# EAGLE design schema_electrica (EAGLE 8.1.1)
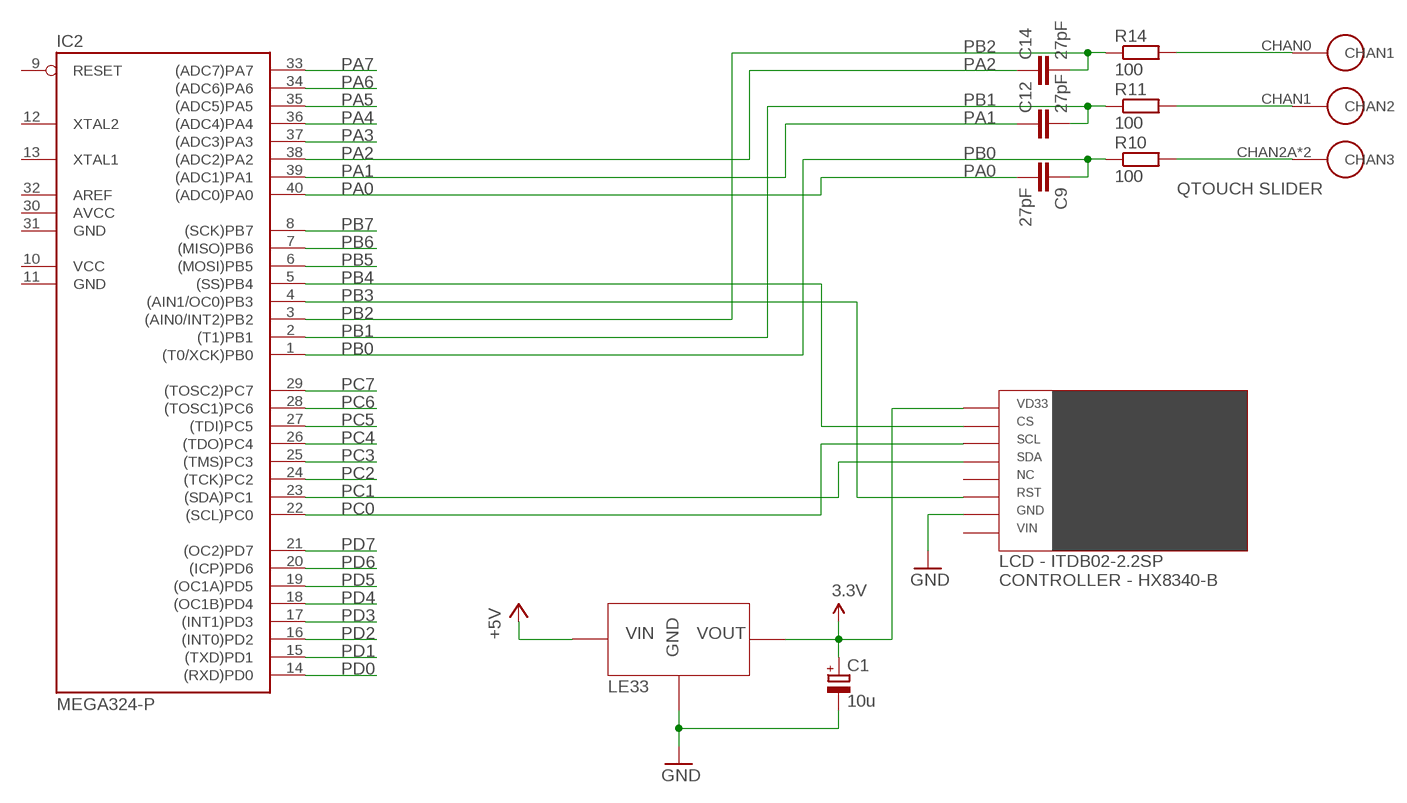
[diagram p0: schematic, sheet 1]

## Parts
C1  10u  CPOL-EUE2.5-5  [E2,5-5]
C9  27pF  C-EUC1206  [C1206]
C12  27pF  C-EUC1206  [C1206]
C14  27pF  C-EUC1206  [C1206]
IC2  MEGA324-P  MEGA16-P  [DIL40]
R10  100  R-EU_M1206  [M1206]
R11  100  R-EU_M1206  [M1206]
R14  100  R-EU_M1206  [M1206]
U$1  QT_SLIDER  [QT_SLIDER]

## Nets
3.3V: C1.+
GND: C1.-
N$5: R14.2 U$1.CHAN0(CHAN1)
N$6: R11.2 U$1.CHAN1(CHAN2)
N$7: R10.2 U$1.CHAN2A(CHAN3) U$1.CHAN2B(CHAN3)
PA0: C9.2 IC2.40((ADC0)PA0)
PA1: C12.1 IC2.39((ADC1)PA1)
PA2: C14.1 IC2.38((ADC2)PA2)
PA3: IC2.37((ADC3)PA3)
PA4: IC2.36((ADC4)PA4)
PA5: IC2.35((ADC5)PA5)
PA6: IC2.34((ADC6)PA6)
PA7: IC2.33((ADC7)PA7)
PB0: C9.1 IC2.1((T0/XCK)PB0) R10.1
PB1: C12.2 IC2.2((T1)PB1) R11.1
PB2: C14.2 IC2.3((AIN0/INT2)PB2) R14.1
PB3: IC2.4((AIN1/OC0)PB3)
PB4: IC2.5((SS)PB4)
PB5: IC2.6((MOSI)PB5)
PB6: IC2.7((MISO)PB6)
PB7: IC2.8((SCK)PB7)
PC0: IC2.22((SCL)PC0)
PC1: IC2.23((SDA)PC1)
PC2: IC2.24((TCK)PC2)
PC3: IC2.25((TMS)PC3)
PC4: IC2.26((TDO)PC4)
PC5: IC2.27((TDI)PC5)
PC6: IC2.28((TOSC1)PC6)
PC7: IC2.29((TOSC2)PC7)
PD0: IC2.14((RXD)PD0)
PD1: IC2.15((TXD)PD1)
PD2: IC2.16((INT0)PD2)
PD3: IC2.17((INT1)PD3)
PD4: IC2.18((OC1B)PD4)
PD5: IC2.19((OC1A)PD5)
PD6: IC2.20((ICP)PD6)
PD7: IC2.21((OC2)PD7)
Unconnected: IC2.9(RESET) IC2.12(XTAL2) IC2.13(XTAL1) IC2.32(AREF)

## Notes on the sheet
- QTOUCH SLIDER
- VD33
- CS
- SCL
- SDA
- NC
- RST
- GND
- VIN
- LCD - ITDB02-2.2SP
  CONTROLLER - HX8340-B
- VIN | VOUT
- GND
- LE33

## Power pins joined to a net without a drawn wire
AVCC: IC2.30(AVCC)
GND: IC2.11(GND) IC2.31(GND)
VCC: IC2.10(VCC)

## Library data of the parts
C1 = resistor:CPOL-EU: POLARIZED CAPACITOR, European symbol
C9 C12 C14 = resistor:C-EU: CAPACITOR, European symbol
IC2 = atmel:MEGA16-P: MICROCONTROLLER 16 Kbytes FLASH 1 kbytes SRAM 512 bytes EEPROM USART 8-channel 10 bit ADC Source: avr.lbr; MPN: ATMEGA16-16PU; OC_FARNELL: 9171142; OC_NEWARK: 01M6885
R10 R11 R14 = resistor:R-EU_: RESISTOR, European symbol
U$1 = 0andrei_custom:QT_SLIDER

## Net classes
1 power: width 0.61 mm

## Board
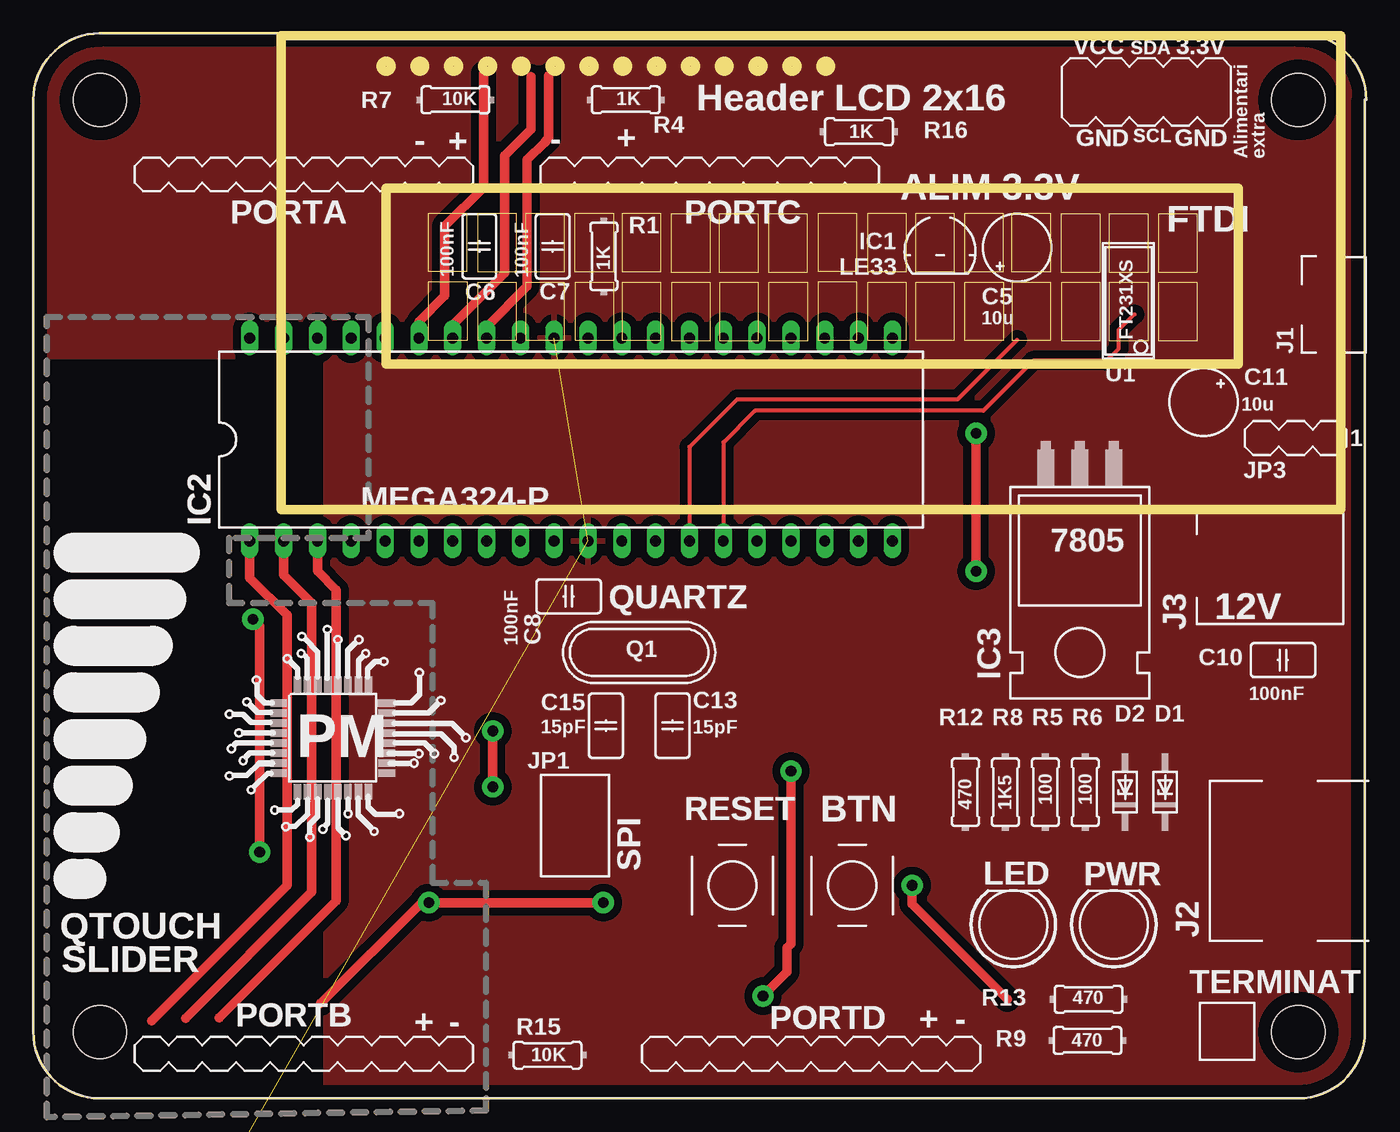
[diagram p1: board, top side]
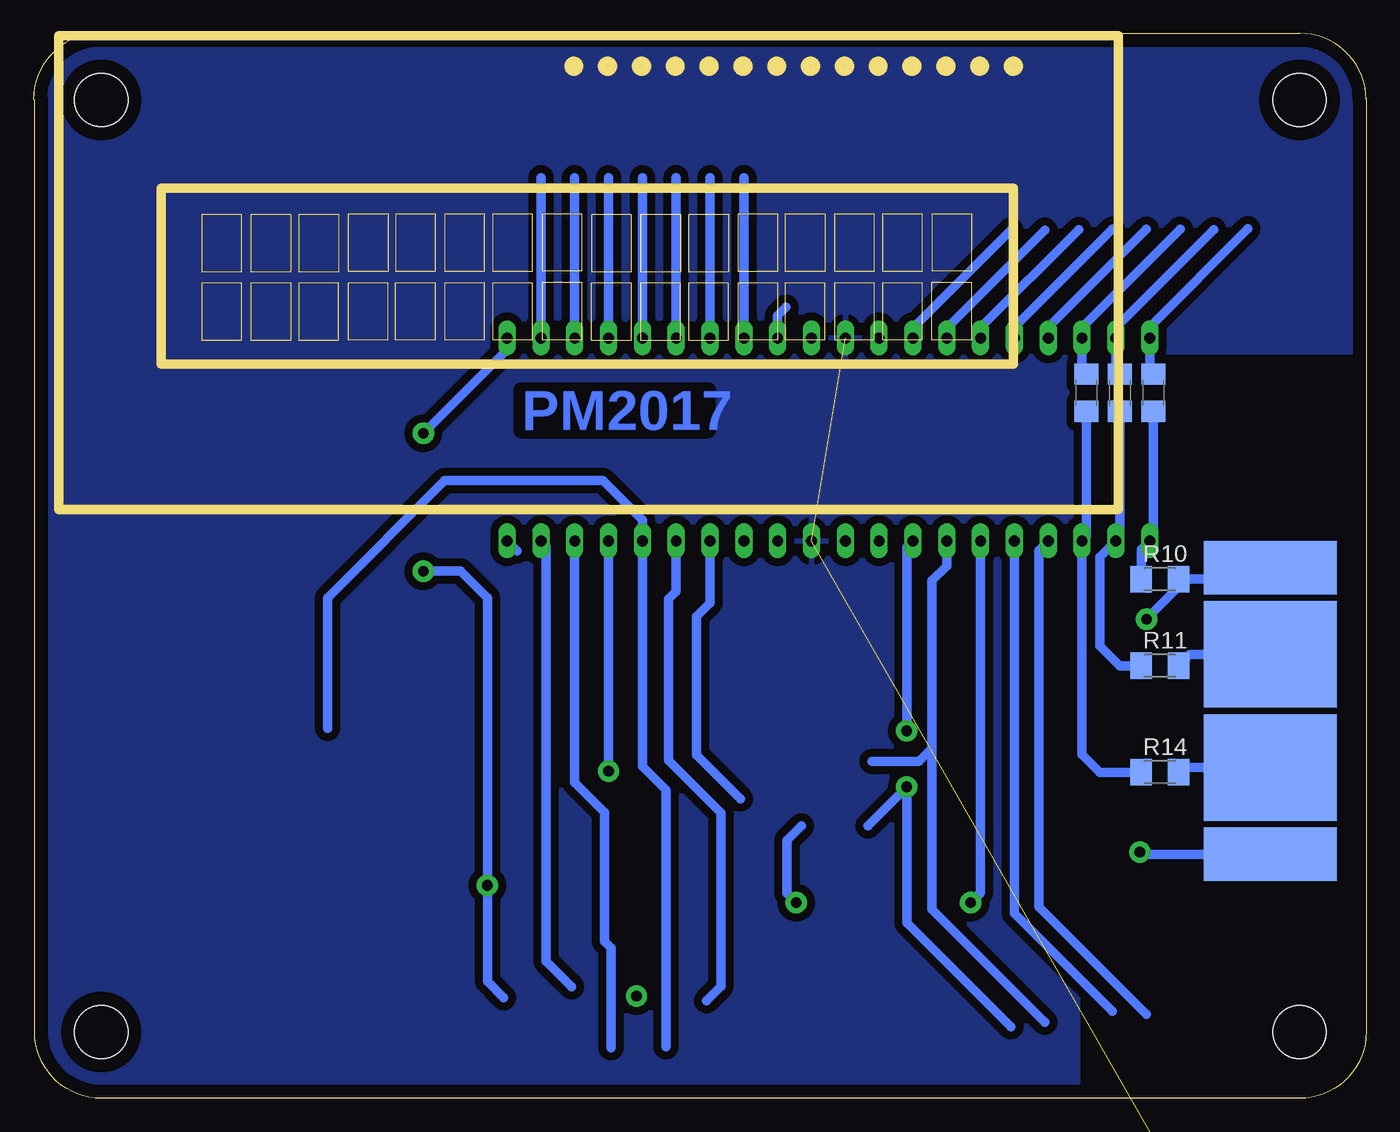
[diagram p2: board, bottom side, seen from below]

Size 100.1 x 80 mm. Coordinates in mm from the lower left corner, seen from the top.
Outline: 100,75 100,5 arc-90 95,0 5,0 arc-90 0,5 0,75 arc-90 5,80 95,80
Outline: 95.1,80 arc-90 100.1,75
Copper layers (1*16): Top 0.035mm / dielectric 1.5mm / Bottom 0.035mm
Design rules "default": minimum track width 10mil, minimum drill 0.6mm, track to track 0.3mm, track to pad 0.3mm, pad to pad 0.3mm, via to via 0.3mm, smd to smd 0mil, copper to edge 40mil, drill to drill 10mil, minimum pad ring 10mil, minimum via ring 8mil, stop-mask expansion 0mil, vias tented up to drill 0mil, thermal gap 20mil
Holes 4 mm at 95,75 5,5 5,75 95,5
Milling: area 26.1,77.2 to 26.9,77.9; area 28.7,77.2 to 29.4,77.9; area 31.2,77.2 to 31.9,77.9; area 33.8,77.2 to 34.5,77.9; area 36.3,77.2 to 37,77.9; area 38.8,77.2 to 39.6,77.9; area 41.4,77.2 to 42.1,77.9; area 43.9,77.2 to 44.6,77.9; area 46.5,77.2 to 47.2,77.9; area 49,77.2 to 49.7,77.9; area 51.5,77.2 to 52.3,77.9; area 54.1,77.2 to 54.8,77.9; area 56.6,77.2 to 57.3,77.9; area 59.2,77.2 to 59.9,77.9; area 29.6,62.1 to 32.6,66.5; area 33.4,62.1 to 36.3,66.4; area 37,62.1 to 39.9,66.4; area 40.7,62.1 to 43.6,66.4; area 29.7,57 to 32.6,61.3; area 33.4,56.9 to 36.3,61.3; area 37,56.9 to 39.9,61.3; area 40.7,56.9 to 43.6,61.3; area 44.2,62.1 to 47.1,66.5; area 47.9,62.1 to 50.8,66.4; area 51.5,62.1 to 54.5,66.4; area 55.2,62.1 to 58.1,66.4; area 44.2,57 to 47.1,61.3; area 47.9,56.9 to 50.9,61.3; area 51.5,56.9 to 54.5,61.3; area 55.2,56.9 to 58.2,61.3; area 58.9,62.1 to 61.9,66.5; area 62.6,62.1 to 65.6,66.4; area 66.2,62.1 to 69.2,66.4; area 69.9,62.1 to 72.9,66.4; area 58.9,57 to 61.9,61.3; area 62.6,56.9 to 65.6,61.3; area 66.2,56.9 to 69.2,61.3; area 69.9,56.9 to 72.9,61.3; area 73.5,62.1 to 76.4,66.5; area 77.2,62.1 to 80.1,66.4; area 80.8,62.1 to 83.7,66.4; area 84.5,62.1 to 87.4,66.4; area 73.5,57 to 76.4,61.3; area 77.2,56.9 to 80.1,61.3; area 80.8,56.9 to 83.7,61.3; area 84.5,56.9 to 87.4,61.3; 8 lines

### Footprints (pad centres in the part's own frame; a part is rotated, then mirrored left to right if it is on the bottom)
E2,5-5 = drill 0.813 pad 1.6: + -1.27,0 | drill 0.813 pad 1.6 octagon: - 1.27,0
C1206 = smd 1.6 x 1.8: 1 -1.4,0; 2 1.4,0
DIL40 = drill 0.813 long: 1 -24.13,-7.62; 2 -21.59,-7.62; 3 -19.05,-7.62; 4 -16.51,-7.62; 5 -13.97,-7.62; 6 -11.43,-7.62; 7 -8.89,-7.62; 8 -6.35,-7.62; 9 -3.81,-7.62; 10 -1.27,-7.62; 11 1.27,-7.62; 12 3.81,-7.62; 13 6.35,-7.62; 14 8.89,-7.62; 15 11.43,-7.62; 16 13.97,-7.62; 17 16.51,-7.62; 18 19.05,-7.62; 19 21.59,-7.62; 20 24.13,-7.62; 21 24.13,7.62; 22 21.59,7.62; 23 19.05,7.62; 24 16.51,7.62; 25 13.97,7.62; 26 11.43,7.62; 27 8.89,7.62; 28 6.35,7.62; 29 3.81,7.62; 30 1.27,7.62; 31 -1.27,7.62; 32 -3.81,7.62; 33 -6.35,7.62; 34 -8.89,7.62; 35 -11.43,7.62; 36 -13.97,7.62; 37 -16.51,7.62; 38 -19.05,7.62; 39 -21.59,7.62; 40 -24.13,7.62
M1206 = smd 1.6 x 2: 1 -1.4,0; 2 1.4,0
QT_SLIDER = smd 8 x 10: CHAN0 -4.25,0; CHAN1 4.25,0 | smd 4 x 10: CHAN2A 10.75,0; CHAN2B -10.75,0

### Placement (x,y rotation side)
C1  -0.1,-28.8 0 top  (outside the outline)
C9  16,53 90 bottom
C12  18.5,53 270 bottom
C14  21,53 270 bottom
IC2  40.39,49.5 0 top
R10  15.5,39 0 bottom
R11  15.5,32.5 0 bottom
R14  15.5,24.5 0 bottom
U$1  7.2,29.1 90 bottom

### Tracks (layer width: path | path; a pad name or v marks a point on that pad's centre or on a via)
GND  (2 unrouted)
  pour Bottom (isolate 0.6): -2.15,79.63 100.94,79.63 100.94,-2.75 21.68,-2.75 21.68,44.84 21.68,56.05 7.04,56.05 -2.1,56.05 -2.1,79.6
  pour Top (isolate 0.6): -1.8,80.8 101.3,80.8 101.3,0.1 22,0.1 22,55.7 -1.8,55.7
N$5
  Bottom 0.7: R14.2 13.75,24.85 U$1.CHAN0
N$6
  Bottom 0.7: R11.2 13.25,33.35 U$1.CHAN1
N$7  (via drill 0.8 pad 1.6)
  Top 0.7: v17,18.5 17,35.5 v16.5,36
  Bottom 0.7: U$1.CHAN2A 8.05,39 R10.2 14.1,38.4 v16.5,36 | U$1.CHAN2B 16.85,18.35 v17,18.5
PA0
  Bottom 0.7: C9.2 16.26,54.66 IC2.40 16.26,57.94 8.89,65.31
PA1
  Bottom 0.7: C12.1 18.8,54.7 IC2.39 18.8,57.9 11.43,65.27
PA2
  Bottom 0.7: C14.1 21.34,54.74 IC2.38 21.34,57.91 13.97,65.28
PA3
  Bottom 0.7: IC2.37 23.88,57.92 16.51,65.29
PA4
  Bottom 0.7: IC2.36 26.42,57.93 19.05,65.3
PA5
  Top 0.7: IC2.35 28.96,58.36 30.9,60.3 30.9,65.5 33.8,68.4 33.8,77
  Bottom 0.7: IC2.35 28.96,57.89 21.59,65.26
PA6
  Top 0.7: IC2.34 31.5,58.1 35.4,62 35.4,70.8 37.4,72.8 37.4,76.72
  Bottom 0.7: IC2.34 31.5,57.85 24.13,65.22
PA7
  Top 0.7: IC2.33 34.04,57.94 37.1,61 37.1,70.5 38.4,71.8 38.6,72 38.7,72.1 38.7,76.82
  Bottom 0.7: IC2.33 34.04,57.86 26.67,65.23
PB0
  Top 0.7: 8.89,5.84 19.05,16 19.05,36.3 16.26,39.09 IC2.1
  Bottom 0.7: R10.1 16.9,41.23 IC2.1 16,42.13 C9.1
PB1
  Top 0.7: 11.43,6.03 20.9,15.5 20.9,37.2 18.8,39.3 IC2.2
  Bottom 0.7: R11.1 18.5,32.5 20,34 20,40.67 IC2.2 18.5,42.17 C12.2
PB2
  Top 0.7: 13.97,6.07 22.75,14.85 22.75,38.2 21.34,39.61 IC2.3
  Bottom 0.7: R14.1 20,24.5 21.34,25.84 IC2.3 21,42.21 C14.2
PB3
  Bottom 0.7: 16.51,6.31 24.6,14.4 24.6,41.15 IC2.4
PB4
  Bottom 0.7: 19.05,6.55 26.42,13.92 IC2.5
PB5  (via drill 0.8 pad 1.6)
  Top 0.7: v42.8,14.7 v29.7,14.7 29.15,14.7 21.59,7.14
  Bottom 0.7: v42.8,14.7 43.5,15.4 43.5,19.4 42.42,20.48 | IC2.6 28.96,15.44 v29.7,14.7
PB6
  Bottom 0.7: IC2.7 31.5,40 32.6,38.9 32.6,26.3 | 32.6,26.3 33.6,25.3 37.14,25.3 | 24.13,5.73 32.6,14.2 32.6,26.3
PB7  (via drill 0.8 pad 1.6)
  Top 0.7: v34.5,27.6 v34.5,23.4
  Bottom 0.7: IC2.8 34.5,41.41 v34.5,27.6 | 37.42,20.48 v34.5,23.4 34.5,13.2 26.67,5.37
PC0
  Bottom 0.7: IC2.22 61.98,69.15
PC1
  Bottom 0.7: IC2.23 59.44,69.15
PC2
  Bottom 0.7: IC2.24 56.9,69.15
PC3
  Bottom 0.7: IC2.25 54.36,69.15
PC4
  Bottom 0.7: IC2.26 51.82,69.15
PC5
  Bottom 0.7: IC2.27 49.28,69.15
PC6
  Bottom 0.7: IC2.28 46.74,69.15
PC7
  Bottom 0.7: IC2.29 44.2,58.8 43.56,59.44
PD0
  Top 0.3: IC2.14 49.28,48.93 52.85,52.5 69.4,52.5 73.88,56.97
  Bottom 0.7: IC2.14 49.28,37.22 50.3,36.2 50.3,25.8 46.99,22.49
PD1
  Top 0.3: IC2.15 51.82,49.27 54.2,51.65 71.35,51.65 75.1,55.4 80.6,55.4 81.5,56.3 81.5,57.7 82.69,58.89
  Bottom 0.7: IC2.15 51.82,38.08 52.4,37.5 52.4,25.38 48.45,21.43 48.45,8.41 49.53,7.33
PD2
  Bottom 0.7: 78,27.81 78,37.59 69.19,46.4 57.3,46.4 54.36,43.46 IC2.16 54.36,24.95 52.6,23.19 52.6,3.89
PD3  (via drill 0.8 pad 1.6)
  Top 0.7: v56.9,24.58 56.9,11.6 56.6,11.3 56.6,9.5 v54.8,7.7
  Bottom 0.7: v56.9,24.58 IC2.17 | v54.8,7.7 54.61,7.51
PD4
  Bottom 0.7: IC2.18 59.44,23.74 57.2,21.5 57.2,11.8 56.7,11.3 56.7,3.81
PD5
  Bottom 0.7: 59.69,8.39 61.6,10.3 61.6,41.5 IC2.19
PD6
  Bottom 0.7: 63.76,41.12 IC2.20
PD7  (via drill 0.8 pad 1.6)
  Top 0.7: v70.8,39.6 v70.8,49.97 | v66,16 66,14.6 73.15,7.45
  Bottom 0.7: v70.8,49.97 64.52,56.25 IC2.21 | v70.8,39.6 68,39.6 66,37.6 v66,16 66,8.8 64.77,7.57

### Text on the board
Bottom: PM2017
tPlace: VCC | SDA | 3.3V | Header LCD 2x16 | GND | SCL | GND | ALIM 3.3V | PORTA | PORTC | FTDI | QUARTZ | 12V | PM | RESET | BTN | SPI | LED | PWR | QTOUCH | SLIDER | TERMINAT | PORTB | PORTD
tNames: - | + | - | + | + | - | + | -
tDocu: Optional | alimentare 3.3V | Optional | alimentare 12V | Optional | QTouch
_tsilk: VCC | SDA | 3.3V | 10K | 1K | R7 | Header LCD 2x16 | R4 | 1K | R16 | GND | SCL | GND | - | + | - | + | Alimentari | extra | ALIM 3.3V | PORTA | PORTC | R1 | FTDI | IC1 | 100nF | 100nF | 1K | LE33 | C6 | C7 | C5 | 10u | FT231XS | J1 | U1 | C11 | 10u | 1 | JP3 | MEGA324-P | IC2 | 7805 | QUARTZ | 12V | J3 | 100nF | C8 | Q1 | C10 | IC3 | 100nF | C15 | C13 | R12 | R8 | R5 | R6 | D2 | D1 | 15pF | 15pF | PM | JP1 | 100 | 100 | 470 | 1K5 | RESET | BTN | SPI | LED | PWR | QTOUCH | QTOUCH | J2 | SLIDER | SLIDER | TERMINAT | R13 | 470 | PORTB | + | - | R15 | PORTD | + | - | R9 | 470 | 10K
215bmp: D:/Downloads/logo.bmp